# Altium schematic sheet 06_Switch.SchDoc
size A4
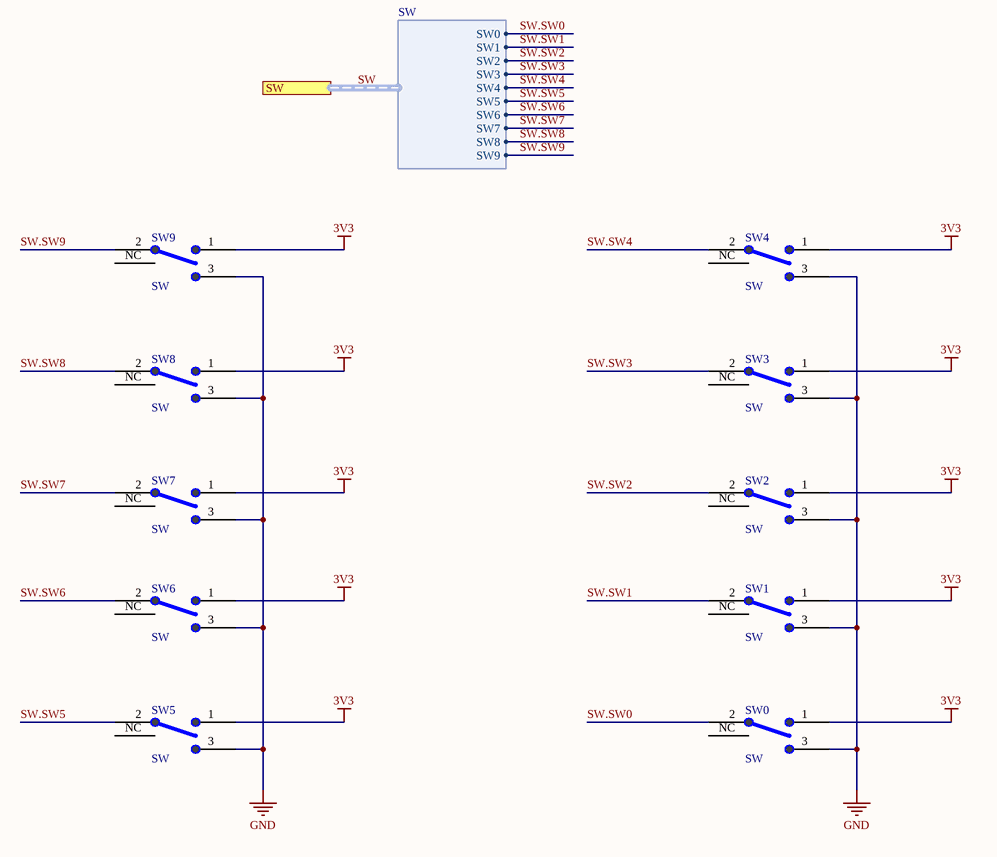
[diagram p0: 06_Switch.SchDoc]

## Parts
SW0  SW  [SW_OS102011MS2Q]
SW1  SW  [SW_OS102011MS2Q]
SW2  SW  [SW_OS102011MS2Q]
SW3  SW  [SW_OS102011MS2Q]
SW4  SW  [SW_OS102011MS2Q]
SW5  SW  [SW_OS102011MS2Q]
SW6  SW  [SW_OS102011MS2Q]
SW7  SW  [SW_OS102011MS2Q]
SW8  SW  [SW_OS102011MS2Q]
SW9  SW  [SW_OS102011MS2Q]

## Ports
SW (harness SW)

## Harnesses
SW: SW0, SW1, SW2, SW3, SW4, SW5, SW6, SW7, SW8, SW9

## Nets
3V3: SW0.1 SW1.1 SW2.1 SW3.1 SW4.1 SW5.1 SW6.1 SW7.1 SW8.1 SW9.1
GND: SW0.3 SW1.3 SW2.3 SW3.3 SW4.3 SW5.3 SW6.3 SW7.3 SW8.3 SW9.3
SW.SW0: SW0.2 ; port SW.SW0
SW.SW1: SW1.2 ; port SW.SW1
SW.SW2: SW2.2 ; port SW.SW2
SW.SW3: SW3.2 ; port SW.SW3
SW.SW4: SW4.2 ; port SW.SW4
SW.SW5: SW5.2 ; port SW.SW5
SW.SW6: SW6.2 ; port SW.SW6
SW.SW7: SW7.2 ; port SW.SW7
SW.SW8: SW8.2 ; port SW.SW8
SW.SW9: SW9.2 ; port SW.SW9

Not connected (* = marked no-connect by the designer): SW0 NC; SW1 NC; SW2 NC; SW3 NC; SW4 NC; SW5 NC; SW6 NC; SW7 NC; SW8 NC; SW9 NC

## Buses and harness runs
harness SW = port SW

## Library data of the parts
SW0-SW9 = SW: OS102011MS2QN OS Series / Miniature Slide Switches / 1-2 , 2-3 (on,on); Load: YES; Supplier 1: Digi-Key; Supplier Part Number 1: CKN9565-ND; Mount: T/H